# Altium schematic sheet power-v29.SchDoc: Power 29V
size Letter; CheckedBy: J. Brinton; CompanyName: Signal Laboratories, Inc.; DrawnBy: J. Brinton; Engineer: J. Brinton; Address1: 3479 Edison Way; Address2: Menlo Park CA 94025; Address3: +1 (877) 778-8435; Address4: siglabs.com; Revision: 3; SheetNumber: 1; SheetTotal: 7
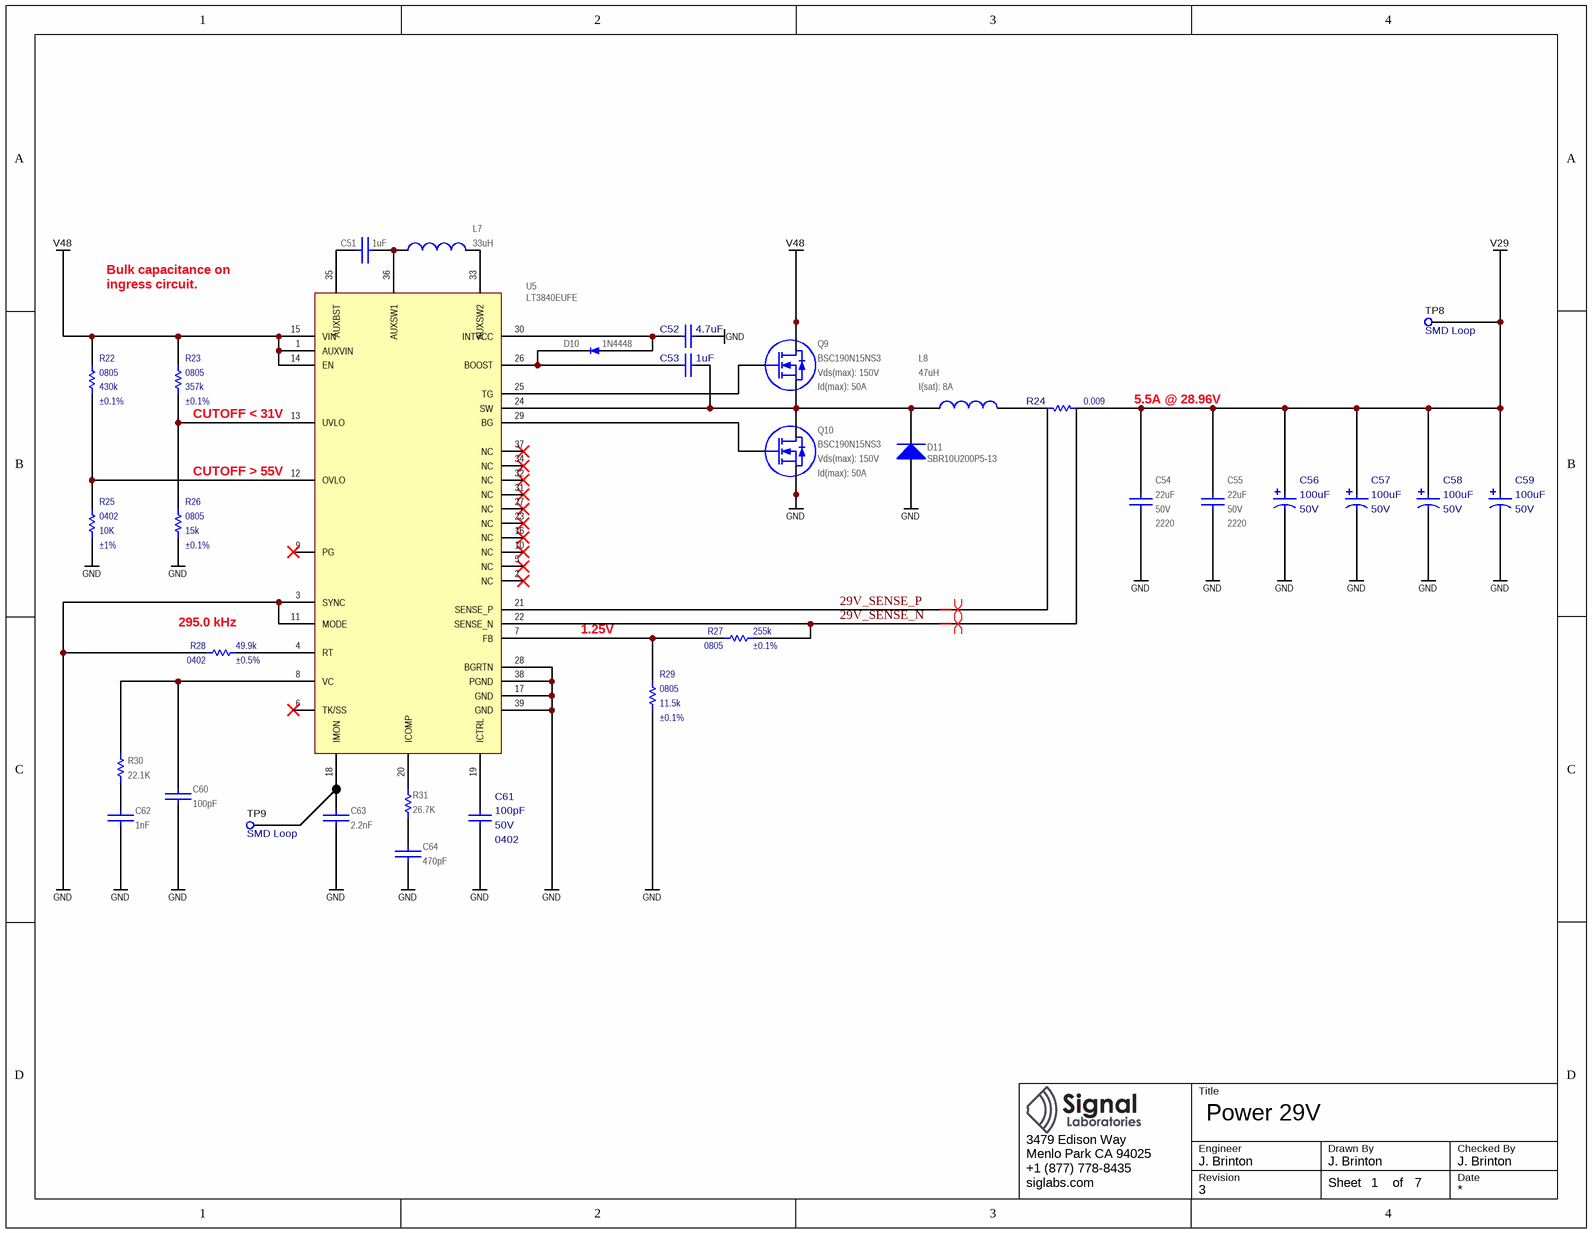
[diagram p0: power-v29.SchDoc]

## Parts
C51  value 1uF  [CAPC100X50X55L25N]  (hidden comment: GRM155R61A105KE15)
C52  value 4.7uF  [CAPC160X80X90L20NA]  (hidden comment: CL10A475KA8NQNC)
C53  value 1uF  [CAPC100X50X55L25N]  (hidden comment: GRM155R61A105KE15)
C54  value 22uF  Voltage: 50V  Package: 2220  [CAPC600X500X500L160N]  (hidden comment: CKG57NX7S1H226M500JJ)
C55  value 22uF  Voltage: 50V  Package: 2220  [CAPC600X500X500L160N]  (hidden comment: CKG57NX7S1H226M500JJ)
C56  value 100uF  Voltage: 50V  [CAPAE660X800D700L260X65N]  (hidden comment: EEE-FTH101XAP)
C57  value 100uF  Voltage: 50V  [CAPAE660X800D700L260X65N]  (hidden comment: EEE-FTH101XAP)
C58  value 100uF  Voltage: 50V  [CAPAE660X800D700L260X65N]  (hidden comment: EEE-FTH101XAP)
C59  value 100uF  Voltage: 50V  [CAPAE660X800D700L260X65N]  (hidden comment: EEE-FTH101XAP)
C60  value 100pF  [CAPC100X50X55L25N]  (hidden comment: GRM1555C1H101FA01D)
C61  value 100pF  Package: 0402  Voltage: 50V  [CAPC100X50X55L25N]  (hidden comment: VJ0402A101KXA)
C62  value 1nF  [CAPC100X50X55L25N]  (hidden comment: GRM1555C1H102JA01)
C63  value 2.2nF  [CAPC100X50X55L25N]  (hidden comment: C0402C222J3GACTU)
C64  value 470pF  [CAPC100X50X55L25N]  (hidden comment: GRM155R71H471JA01)
D10  Alternative P/N: 1N4448  [SOD323]  (hidden comment: 1N4448HWS-7-F)
D11  SBR10U200P5-13  [DIODES_POWERDI5]
L7  value 33uH  [ME3220]  (hidden comment: ME3220-333KL)
L8  value 47uH  I(sat): 8A  [HCM1A1707]  (hidden comment: HCM1A1707-470-R)
Q9  BSC190N15NS3  Vds(max): 150V  Id(max): 50A  [TDSON-8]
Q10  BSC190N15NS3  Vds(max): 150V  Id(max): 50A  [TDSON-8]
R22  value 430k  Tolerance: ±0.1%  Package: 0805  [RESC2012X70N]  (hidden comment: RT0805BRD07430KL)
R23  value 357k  Tolerance: ±0.1%  Package: 0805  [RESC2012X70N]  (hidden comment: RT0805BRD07357KL)
R24  value 0.009  [KRL3216T4]  (hidden comment: KRL3216T4A-M-R009-F)
R25  value 10K  Tolerance: ±1%  Package: 0402  [RESC2012X70N]  (hidden comment: ERJ-2RKF1002X)
R26  value 15k  Tolerance: ±0.1%  Package: 0805  [RESC2012X70N]  (hidden comment: RG2012P-153-B-T5)
R27  value 255k  Tolerance: ±0.1%  Package: 0805  [RESC2012X70N]  (hidden comment: PTN0805E2553BST1)
R28  value 49.9k  Tolerance: ±0.5%  Package: 0402  [RESC1005X40N]  (hidden comment: RR0510P-4992-D)
R29  value 11.5k  Tolerance: ±0.1%  Package: 0805  [RESC2012X70N]  (hidden comment: RT0805BRD0711K5L)
R30  value 22.1K  [RESC1005X40N]  (hidden comment: ERJ-2RKF2212X)
R31  value 26.7K  [RESC1005X40N]  (hidden comment: ERJ-2RKF2672X)
TP8  Notes: SMD Loop  [5015]  (hidden comment: 5015)
TP9  Notes: SMD Loop  [5015]  (hidden comment: 5015)
U5  LT3840EUFE  [QFN39P40_600X400X80L40X20T465X265N]

## Nets
GND: C52.2 C54.1 C55.1 C56.2 C57.2 C58.2 C59.2 C60.1 C61.2 C62.2 C63.2 C64.1 D11.A Q10.1(S) Q10.2(S) Q10.3(S) R25.1 R26.1 R28.2 R29.1 U5.3(SYNC) U5.11(MODE) U5.17(GND) U5.28(BGRTN) U5.38(PGND) U5.39(GND)
V29: C54.2 C55.2 C56.1 C57.1 C58.1 C59.1 R24.2 TP8.1
V48: Q9.5(D) Q9.6(D) Q9.7(D) Q9.8(D) Q9.9(D) R22.2 R23.2 U5.1(AUXVIN) U5.14(EN) U5.15(VIN)
29V_SENSE_N: R24.4 R27.1 U5.22(SENSE_N)
29V_SENSE_P: R24.3 U5.21(SENSE_P)
NetC51_1: C51.1 L7.1 U5.36(AUXSW1)
NetC51_2: C51.2 U5.35(AUXBST)
NetC52_1: C52.1 D10.A U5.30(INTVCC)
NetC53_1: C53.1 D10.K U5.26(BOOST)
NetC53_2: C53.2 D11.K L8.1 Q9.1(S) Q9.2(S) Q9.3(S) Q10.5(D) Q10.6(D) Q10.7(D) Q10.8(D) Q10.9(D) U5.24(SW)
NetC60_2: C60.2 R30.2 U5.8(VC)
NetC61_1: C61.1 U5.19(ICTRL)
NetC62_1: C62.1 R30.1
NetC63_1: C63.1 TP9.1 U5.18(IMON)
NetC64_2: C64.2 R31.2
NetL7_2: L7.2 U5.33(AUXSW2)
NetL8_2: L8.2 R24.1
NetQ9_4: Q9.4(G) U5.25(TG)
NetQ10_4: Q10.4(G) U5.29(BG)
NetR22_1: R22.1 R25.2 U5.12(OVLO)
NetR23_1: R23.1 R26.2 U5.13(UVLO)
NetR27_2: R27.2 R29.2 U5.7(FB)
NetR28_1: R28.1 U5.4(RT)
NetR31_1: R31.1 U5.20(ICOMP)

Not connected (* = marked no-connect by the designer): U5 2(NC)* 5(NC)* 6(TK/SS)* 9(PG)* 10(NC)* 16(NC)* 23(NC)* 27(NC)* 31(NC)* 32(NC)* 34(NC)* 37(NC)*

## Layout directives
differential pair: 29V_SENSE_N, 29V_SENSE_P

## Notes on the sheet
- Bulk capacitance on
- ingress circuit.
- (near R23) CUTOFF < 31V
- 5.5A @ 28.96V
- CUTOFF > 55V
- (near R28) 295.0 kHz
- 1.25V
- Title
- Engineer
- Revision
- Drawn By
- Checked By
- Date
- Sheet
- of

## Library data of the parts
C51 = CAP: Ceramic Capacitor 1uF ±10% 10V X5R 0402; Manufacturer: Murata; Tr: -55:125; Manufacturer P/N: GRM155R61A105KE15; Package: 0402; Tolerance: ±10%; Voltage: 10V
C52 = TMK212B7475KG: Ceramic Capacitor 4.7uF ±10% 25V X5R 0603; Manufacturer: Samsung; Tr: -55:85; Manufacturer P/N: CL10A475KA8NQNC; Tolerance: ±10%; Package: 0603; Voltage: 25V
C53 = UMK212B7105KG: Ceramic Capacitor 1uF ±10% 10V X5R 0402; Manufacturer: Murata; Manufacturer P/N: GRM155R61A105KE15; Tolerance: ±10%; Tr: *; Package: 0402; Voltage: 10V
C54 C55 = CAP: Ceramic Capacitor 22uF ±20% 50V X7S Stacked; Manufacturer: TDK; Tr: -55:125; Manufacturer P/N: CKG57NX7S1H226M500JJ; Tolerance: ±20%
C56-C59 = CAP_POL: Aluminum Electrolytic Capacitor 100uF ±20% 50V; Manufacturer: Panasonic; Tr: -55:105; Manufacturer P/N: EEE-FTH101XAP; Tolerance: ±20%; Package: 6.3mm Radial
C60 = CAP: Ceramic Capacitor 100pF ±1% 50V NP0 0402; Manufacturer: Murata; Tr: -55:125; Manufacturer P/N: GRM1555C1H101FA01D; Voltage: 50V; Package: 0402; Tolerance: ±1%
C61 = VJ0402A101KXA: Ceramic Capacitor 100pF ±10% 50V C0G 0402; Manufacturer: Vishay; Tr: -55:150; Manufacturer P/N: VJ0402A101KXA; Tolerance: ±10%
C62 = CAP: Ceramic Capacitor 1nF ±5% 50V NP0 0402; Manufacturer: Murata; Tr: -55:125; Manufacturer P/N: GRM1555C1H102JA01; Voltage: 50V; Package: 0402; Tolerance: ±5%
C63 = CAP: Ceramic Capacitor 2.2nF ±5% 25V NP0 0402; Manufacturer: Kemet; Tr: -55:125; Manufacturer P/N: C0402C222J3GACTU; Package: 0402; Tolerance: ±5%; Voltage: 25V
C64 = CAP: Ceramic Capacitor 470pF ±5% 50V X7R 0402; Manufacturer: Murata; Tr: -55:125; Manufacturer P/N: GRM155R71H471JA01; Voltage: 50V; Package: 0402; Tolerance: ±5%
D10 = 1N4448HWS-7-F: Schottky Diode 80V 250mA SOD323; Manufacturer: Diodes Inc; Manufacturer P/N: 1N4448HWS-7-F; Package: SOD323
D11 = PDS5100H: Schottky Diode 200V 10A SMD; Manufacturer: Diodes Inc; Manufacturer P/N: SBR10U200P5-13; Current: 10A; Reverse Voltage (max): 200V; Package: PowerDi-5
L7 = COIL: Inductor 33uH ±10% 500mA SMD; Manufacturer: Coilcraft; Tr: -40:85; Manufacturer P/N: ME3220-333KL; I(sat): 500mA; Package: *; Tolerance: ±10%
L8 = COIL: Inductor 47uH, 8A(sat), SMD; Manufacturer: Eaton; Manufacturer P/N: HCM1A1707-470-R
Q9 Q10 = BSC190N15NS3: MOSFET N-Channel Enhancement Mode; Manufacturer: Infineon; Rds(on): 19mOhm; Manufacturer P/N: BSC190N15NS3
R22 = RES: Thin Film Resistor 430k +/-0.1% SMD 0805; Manufacturer: Yageo; Tr: -55:155; Tcr: *; Manufacturer P/N: RT0805BRD07430KL; Alternatives: *; Voltage: *; Power: *
R23 = RES: Thin Film Resistor 357k +/-0.1% SMD 0805; Manufacturer: Yageo; Tr: -55:155; Tcr: *; Manufacturer P/N: RT0805BRD07357KL; Alternatives: *; Voltage: *; Power: *
R24 = KRL3216T4A-M-R009-F: Current Sense Resistor 9 mOhms +/-1% SMD 4-Terminal; Manufacturer: Susumu; Tolerance: ±1%; Tr: -55:+155; Manufacturer P/N: KRL3216T4A-M-R009-F
R25 = RES: Thick Film Resistor 10k ±1% 0.1W 50V 0402; Manufacturer: Panasonic; Tr: -55:155; Tcr: *; Manufacturer P/N: ERJ-2RKF1002X; Alternatives: *; Voltage: *; Power: *
R26 = RES: Thin Film Resistor 15k +/-0.1% SMD 0805; Manufacturer: Susumu; Tr: -55:155; Tcr: *; Manufacturer P/N: RG2012P-153-B-T5; Alternatives: *; Voltage: *; Power: *
R27 = RES: Thin Film Resistor 255k +/-0.1% SMD 0805; Manufacturer: Vishay; Tr: -55:155; Tcr: *; Manufacturer P/N: PTN0805E2553BST1; Alternatives: *; Voltage: *; Power: *
R28 = RES: Thin Film Resistor 49.9k +/-0.5% SMD 0402; Manufacturer: Susumu; Tr: -55:155; Tcr: *; Manufacturer P/N: RR0510P-4992-D; Alternatives: *; Voltage: *; Power: *
R29 = RES: Thin Film Resistor 11.5k +/-0.1% SMD 0805; Manufacturer: Yageo; Tr: -55:155; Tcr: *; Manufacturer P/N: RT0805BRD0711K5L; Alternatives: *; Voltage: *; Power: *
R30 = RES 0402: Thick Film Resistor 22.1k ±1% 0402; Manufacturer: Panasonic; Tr: -55:155; Package: 0402; Manufacturer P/N: ERJ-2RKF2212X; Tolerance: ±1%
R31 = RES 0402: Thick Film Resistor 26.7k ±1% 0402; Manufacturer: Panasonic; Tr: -55:155; Package: 0402; Manufacturer P/N: ERJ-2RKF2672X; Tolerance: ±1%
TP8 TP9 = TEST_POINT_SMD_50: Test Point SMD; Manufacturer: Keystone; Manufacturer P/N: 5015
U5 = LT3840EUFE: Synchronous Regulator Controller; Manufacturer: Linear Technology; Alternative P/N: LT3840IUFE; Manufacturer P/N: LT3840EUFE